# Altium schematic sheet 05_MISC.SchDoc
size A4; SheetNumber: 5
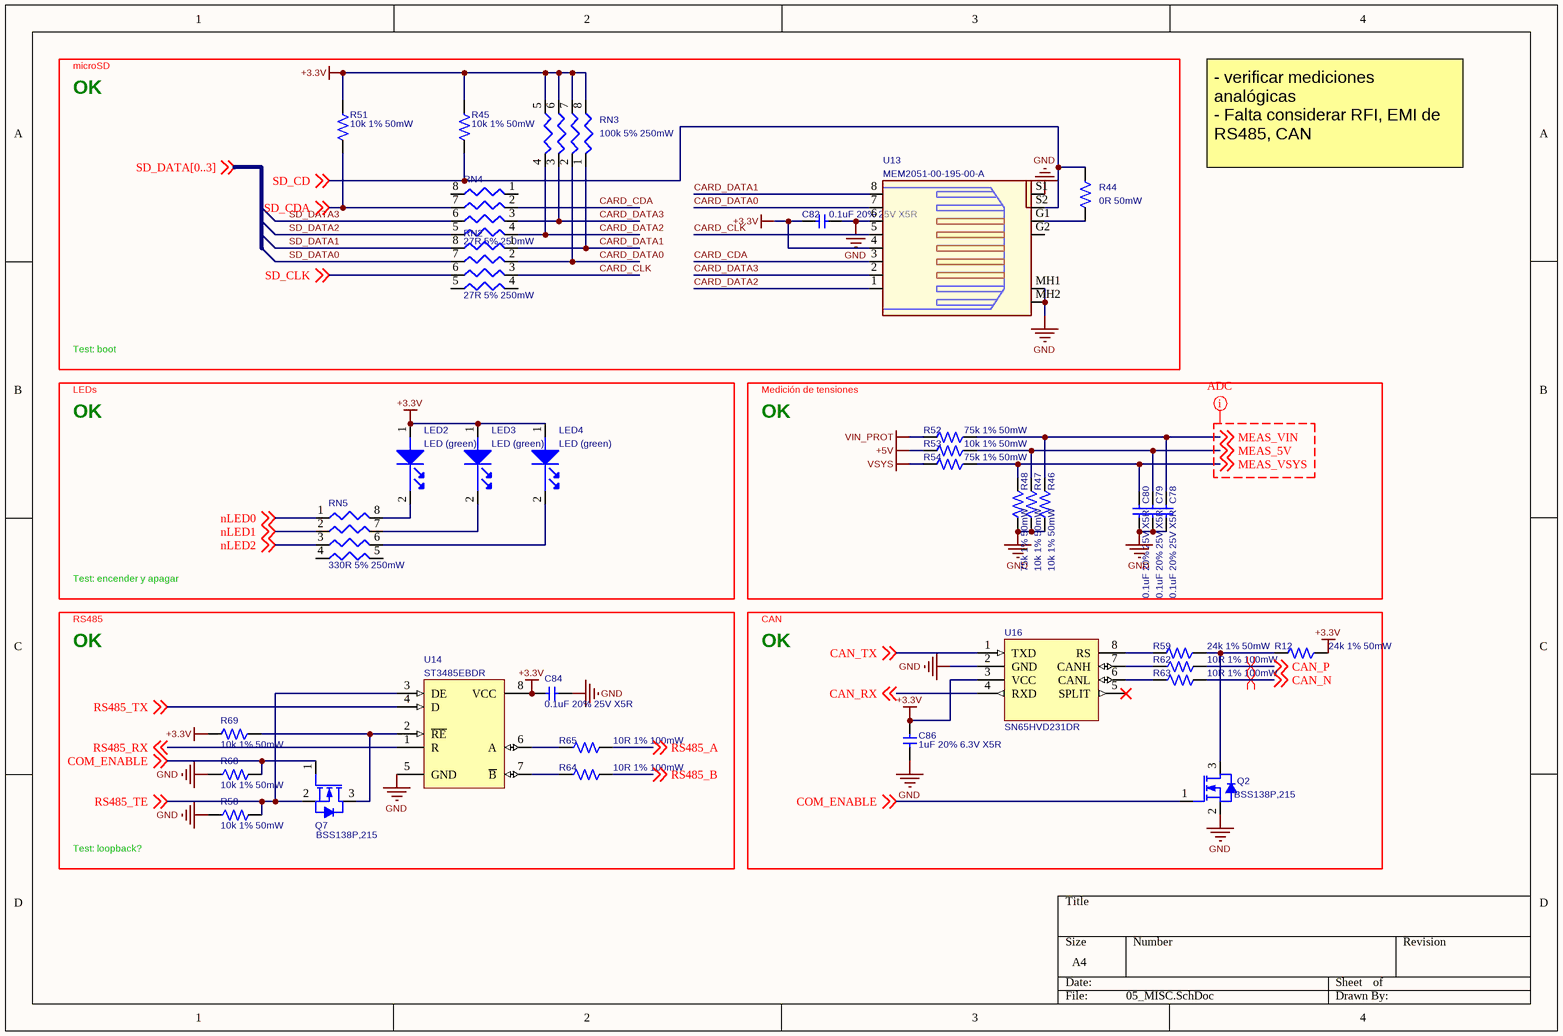
[diagram p0: 05_MISC.SchDoc]

## Parts
C78  0.1uF 20% 25V X5R  [CAPC1005N]
C79  0.1uF 20% 25V X5R  [CAPC1005N]
C80  0.1uF 20% 25V X5R  [CAPC1005N]
C82  0.1uF 20% 25V X5R  [CAPC1005N]
C84  0.1uF 20% 25V X5R  [CAPC1005N]
C86  1uF 20% 6.3V X5R  [CAPC1005N]
LED2  LED (green)  [LEDC1608N]
LED3  LED (green)  [LEDC1608N]
LED4  LED (green)  [LEDC1608N]
Q2  BSS138P,215  [SOT95P230X110-3N]
Q7  BSS138P,215  [SOT95P230X110-3N]
R12  24k 1% 50mW  [RESC1005X40N]
R44  0R 50mW  [RESC1005X40N]
R45  10k 1% 50mW  [RESC1005X40N]
R46  10k 1% 50mW  [RESC1005X40N]
R47  10k 1% 50mW  [RESC1005X40N]
R48  75k 1% 50mW  [RESC1005X40N]
R51  10k 1% 50mW  [RESC1005X40N]
R52  75k 1% 50mW  [RESC1005X40N]
R53  10k 1% 50mW  [RESC1005X40N]
R54  75k 1% 50mW  [RESC1005X40N]
R58  10k 1% 50mW  [RESC1005X40N]
R59  24k 1% 50mW  [RESC1005X40N]
R62  10R 1% 100mW  [RESC1608X40N]
R63  10R 1% 100mW  [RESC1608X40N]
R64  10R 1% 100mW  [RESC1608X40N]
R65  10R 1% 100mW  [RESC1608X40N]
R68  10k 1% 50mW  [RESC1005X40N]
R69  10k 1% 50mW  [RESC1005X40N]
RN2  27R 5% 250mW  [YC164]
RN3  100k 5% 250mW  [YC164]
RN4  27R 5% 250mW  [YC164]
RN5  330R 5% 250mW  [YC164]
U13  MEM2051-00-195-00-A  [101-00660-68-6+MEM2051-00-195-00-A_revC]
U14  ST3485EBDR  [SOIC127P600X175-8N]
U16  SN65HVD231DR  [SOIC127P600X175-8N]

## Blocks framed on the sheet
OK: C82 R44 R45 R51 RN2-RN4 U13
OK: LED2-LED4 RN5
OK: C78-C80 R46-R48 R52-R54
OK: C84 Q7 R58 R64 R65 R68 R69 U14
OK: C86 Q2 R12 R59 R62 R63 U16

## Nets
+3.3V: C82.1 C84.1 C86.1 LED2.1(CATHODE) LED3.1(CATHODE) LED4.1(CATHODE) R12.1 R45.1 R51.1 R69.2 RN3.5 RN3.6 RN3.7 RN3.8 U13.4 U14.8(VCC) U16.3(VCC)
+5V: R53.2
GND: C78.1 C79.1 C80.1 C82.2 C84.2 C86.2 Q2.2(S) R46.1 R47.1 R48.1 R58.1 R68.1 U13.6 U13.MH1 U13.MH2 U13.S1 U14.5(GND) U16.2(GND)
VIN_PROT: R52.2
VSYS: R54.2
CAN_N: R63.2 ; off-sheet CAN_N
CAN_P: R62.2 ; off-sheet CAN_P
CAN_RX: U16.4(RXD) ; off-sheet CAN_RX
CAN_TX: U16.1(TXD) ; off-sheet CAN_TX
CARD_CDA: RN4.2 U13.3
CARD_CLK: RN2.3 U13.5
CARD_DATA0: RN2.2 RN3.2 U13.7
CARD_DATA1: RN2.1 RN3.1 U13.8
CARD_DATA2: RN3.4 RN4.4 U13.1
CARD_DATA3: RN3.3 RN4.3 U13.2
COM_ENABLE: Q2.1(G) Q7.1(G) R68.2 ; off-sheet COM_ENABLE
MEAS_5V: C79.2 R47.2 R53.1 ; off-sheet MEAS_5V
MEAS_VIN: C78.2 R46.2 R52.1 ; off-sheet MEAS_VIN
MEAS_VSYS: C80.2 R48.2 R54.1 ; off-sheet MEAS_VSYS
nLED0: RN5.1 ; off-sheet nLED0
nLED1: RN5.2 ; off-sheet nLED1
nLED2: RN5.3 ; off-sheet nLED2
RS485_A: R65.2 ; off-sheet RS485_A
RS485_B: R64.2 ; off-sheet RS485_B
RS485_RX: U14.1(R) ; off-sheet RS485_RX
RS485_TE: Q7.2(S) R58.2 U14.3(DE) ; off-sheet RS485_TE
RS485_TX: U14.4(D) ; off-sheet RS485_TX
SD_CD: R44.1 R45.2 U13.S2 ; off-sheet SD_CD
SD_CDA: R51.2 RN4.7 ; off-sheet SD_CDA
SD_CLK: RN2.6 ; off-sheet SD_CLK
SD_DATA0: RN2.7
SD_DATA1: RN2.8
SD_DATA2: RN4.5
SD_DATA3: RN4.6
NetLED2_2: LED2.2(ANODE) RN5.8
NetLED3_2: LED3.2(ANODE) RN5.7
NetLED4_2: LED4.2(ANODE) RN5.6
NetQ2_3: Q2.3(D) R12.2 R59.1
NetQ7_3: Q7.3(D) R69.1 U14.2(~{RE})
NetR44_2: R44.2 U13.G1
NetR59_2: R59.2 U16.8(RS)
NetR62_1: R62.1 U16.7(CANH)
NetR63_1: R63.1 U16.6(CANL)
NetR64_1: R64.1 U14.7(~{B})
NetR65_1: R65.1 U14.6(A)

Not connected (* = marked no-connect by the designer): RN2 4 5; RN4 1 8; RN5 4 5; U13 G2; U16 5(SPLIT)*

## Layout directives
net class ADC: MEAS_5V, MEAS_VIN, MEAS_VSYS
differential pair: CAN_N, CAN_P

## Notes on the sheet
- microSD
- - verificar mediciones analógicas
  - Falta considerar RFI, EMI de RS485, CAN
- Test: boot
- LEDs
- Medición de tensiones
- Test: encender y apagar
- RS485
- CAN
- Test: loopback?

## Library data of the parts
C78-C80 C82 = C_Dup1: Capacitor, Ceramic; FP_DESC: C0402; MFG_PN: CL05A104KA5NNNC; MFG: SAMSUNG; Symbol Checked: Ok; Replacement Allowed: Ask; Footprint Checked: Assign OK, Footprint OK; TECHNOLOGY: X5R; TOLERANCE: 20%; VALUE: 0.1uF; VOLTAGE: 25V
C84 = C_Dup1: Capacitor, Ceramic; MFG: SAMSUNG; MFG_PN: CL05A104KA5NNNC; FP_DESC: C0402; Symbol Checked: Ok; Replacement Allowed: Ask; Footprint Checked: Assign OK, Footprint OK; TECHNOLOGY: X5R; TOLERANCE: 20%; VALUE: 0.1uF; VOLTAGE: 25V
C86 = C_Dup1: Capacitor, Ceramic; MFG: SAMSUNG; MFG_PN: CL05A105KQ5NNNC; FP_DESC: C0402; Symbol Checked: Ok; Replacement Allowed: Ask; Footprint Checked: Assign OK, Footprint OK; TECHNOLOGY: X5R; TOLERANCE: 20%; VALUE: 1uF; VOLTAGE: 6.3V
LED2-LED4 = Led Red HSMC-C170: LED; FP_DESC: LED0603; MFG: <GENERIC>; Symbol Checked: Ok; Replacement Allowed: Yes; MFG_PN: <GENERIC>; Footprint Checked: Assign OK, Footprint OK
Q2 Q7 = TRA1147: MOSFET, N channel; FP_DESC: SOT23-3; MFG: NXP; Symbol Checked: Ok; Replacement Allowed: No; Footprint Checked: Assign OK, Footprint OK; MFG_PN: BSS138P,215
R12 R44-R48 R51-R54 R58 R59 R68 R69 = R: Resistor, SMD; FP_DESC: R0402; MFG_PN: <GENERIC>; Symbol Checked: Ok; Replacement Allowed: Yes; MFG: <GENERIC>; Footprint Checked: Assign OK, Footprint OK; POWER: 50mW
  R12 R59: TOLERANCE: 1%; VALUE: 24k
  R44: VALUE: 0R
  R45-R47 R51 R53 R58 R68 R69: TOLERANCE: 1%; VALUE: 10k
  R48 R52 R54: TOLERANCE: 1%; VALUE: 75k
R62-R65 = R: Resistor, SMD; FP_DESC: R0603; MFG_PN: <GENERIC>; Symbol Checked: Ok; Replacement Allowed: Yes; MFG: <GENERIC>; Footprint Checked: Assign OK, Footprint OK; POWER: 100mW; TOLERANCE: 1%; VALUE: 10R
RN2 RN4 RN5 = RESNW_IS_0: Resistor array; MFG: <GENERIC>; FP_DESC: Res. Pack 4x0603 Convex; Symbol Checked: Ok; Replacement Allowed: Yes; MFG_PN: <GENERIC>; Footprint Checked: Assign OK, Footprint OK; POWER: 250mW; TOLERANCE: 5%
  RN2 RN4: VALUE: 27R
  RN5: VALUE: 330R
RN3 = RESNW_IS_0: Resistor array; FP_DESC: Res. Pack 4x0603 Convex; MFG_PN: <GENERIC>; Symbol Checked: Ok; Replacement Allowed: Yes; MFG: <GENERIC>; Footprint Checked: Assign OK, Footprint OK; POWER: 250mW; TOLERANCE: 5%; VALUE: 100k
U13 = 112A-TAAR-R03: microSD socket; FP_DESC: Micro SD, Push-Push; MFG: GCT; Symbol Checked: Ok; Replacement Allowed: Ask; MFG_PN: MEM2051-00-195-00-A; Footprint Checked: Assign OK, Footprint OK
U14 = SN75176BD: Differential Bus Transceiver; FP_DESC: SOIC-8; MFG: ST; Symbol Checked: Ok; Replacement Allowed: No; MFG_PN: ST3485EBDR; Footprint Checked: Assign OK, Footprint OK
U16 = TJA1042TK/3: High speed CAN transceiver; MFG: TI; FP_DESC: SOIC-8; Symbol Checked: Ok; Replacement Allowed: No; MFG_PN: SN65HVD231DR; Footprint Checked: Assign OK, Footprint OK